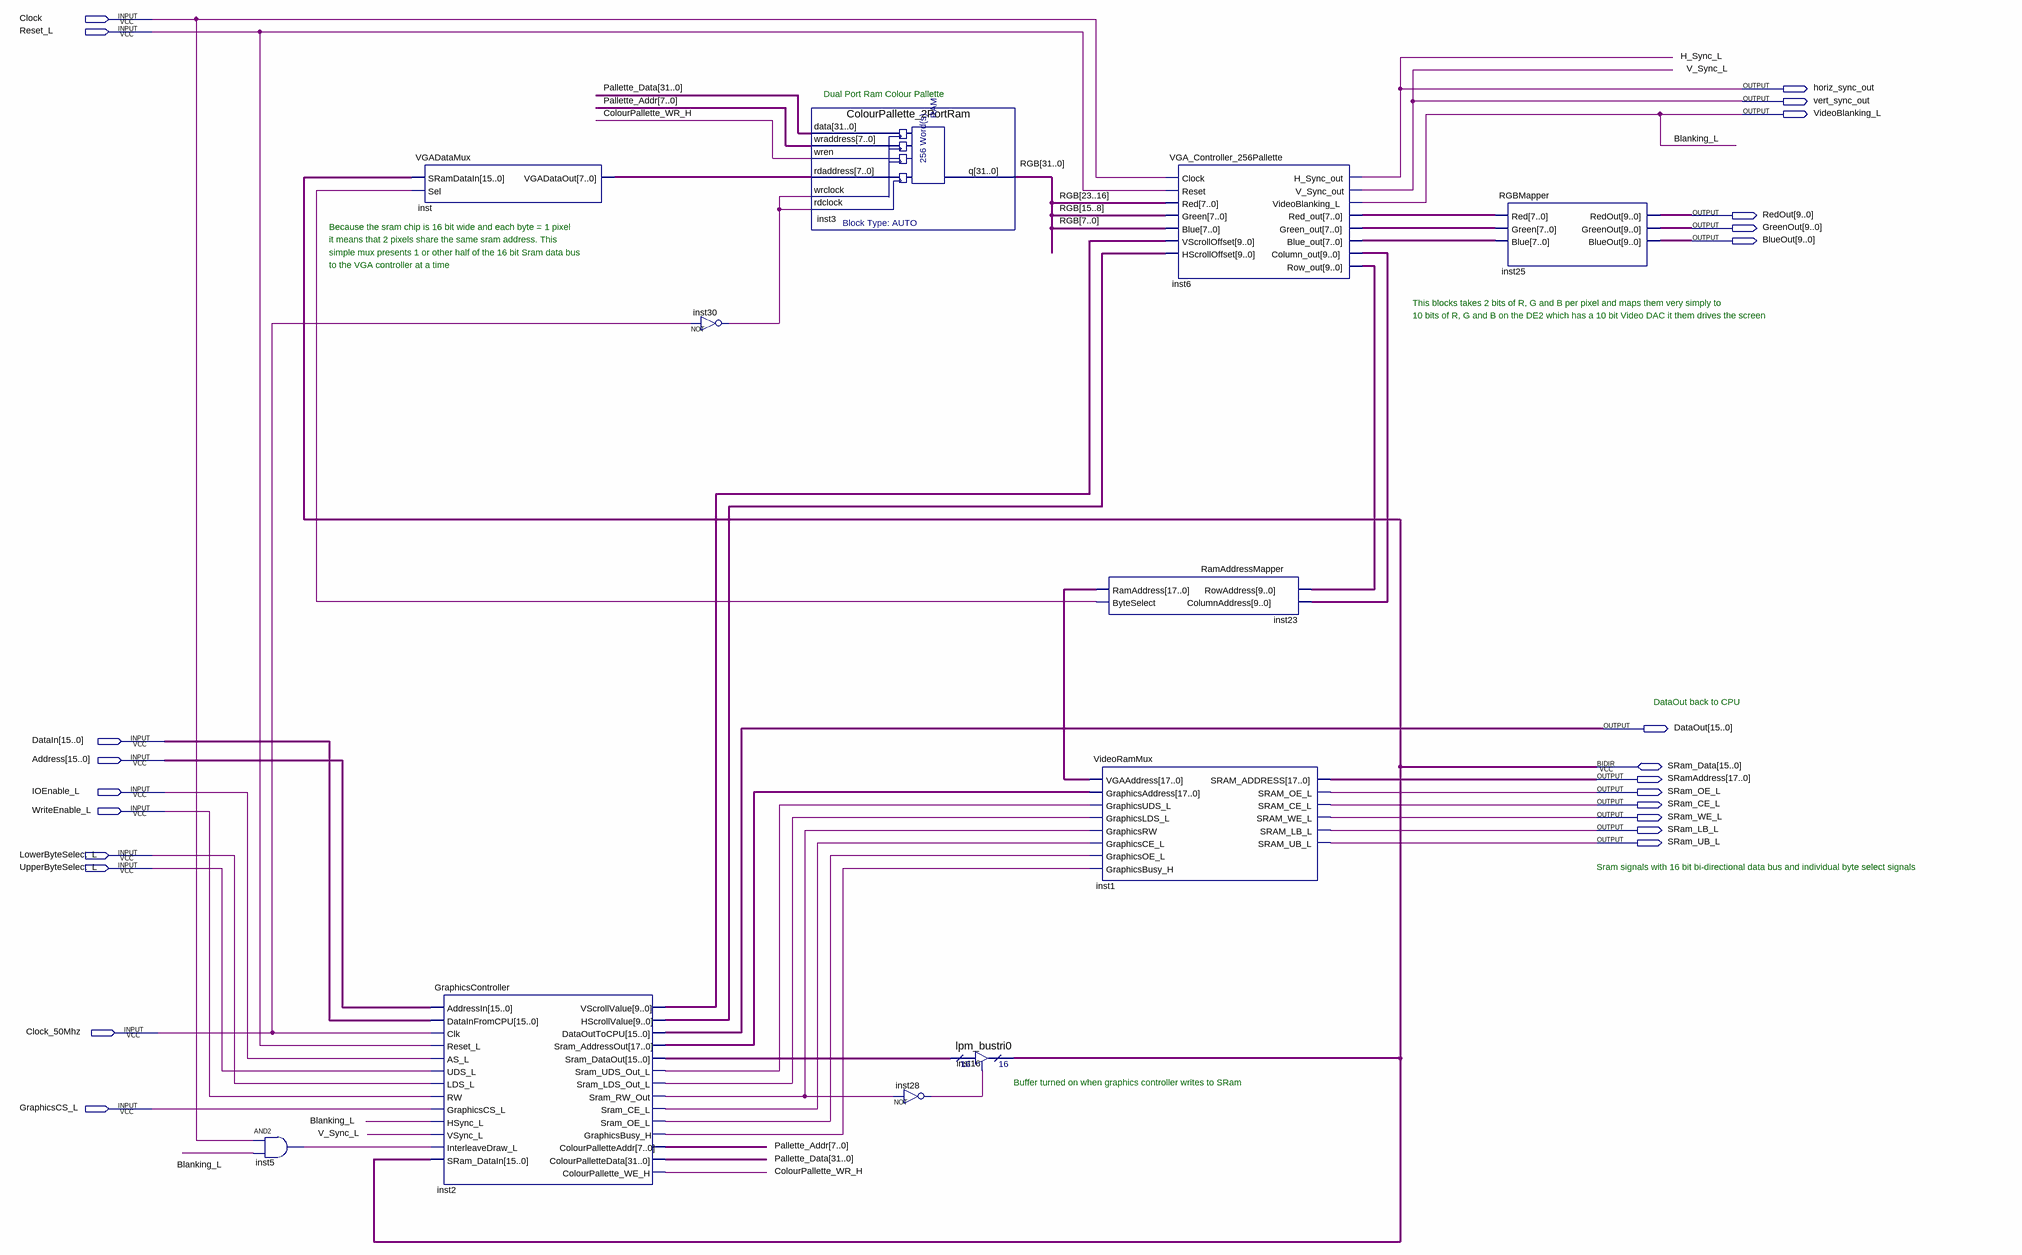
[diagram p0: schematic sheet]
// Quartus schematic Video_Controller800x480.bdf as structural Verilog: 11 symbols, 24 pins
module Video_Controller800x480 (
  input  Clock,
  input  Reset_L,
  input  [15:0] DataIn,
  input  [15:0] Address,
  input  IOEnable_L,
  input  WriteEnable_L,
  input  LowerByteSelect_L,
  input  UpperByteSelect_L,
  input  Clock_50Mhz,
  input  GraphicsCS_L,
  inout  [15:0] SRam_Data,
  output horiz_sync_out,
  output vert_sync_out,
  output VideoBlanking_L,
  output [9:0] RedOut,
  output [9:0] GreenOut,
  output [9:0] BlueOut,
  output [15:0] DataOut,
  output [17:0] SRamAddress,
  output SRam_OE_L,
  output SRam_CE_L,
  output SRam_WE_L,
  output SRam_LB_L,
  output SRam_UB_L
);

  wire ColourPallette_WR_H, inst2_graphicsbusy_h, inst2_sram_ce_l, inst2_sram_lds_out_l, inst2_sram_oe_l,
       inst2_sram_rw_out, inst2_sram_uds_out_l, inst5_out, inst23_byteselect, inst28_out, inst30_out;
  wire [7:0] inst6_blue_out, inst6_green_out, inst6_red_out, inst_vgadataout, Pallette_Addr;
  wire [9:0] inst2_hscrollvalue, inst2_vscrollvalue, inst6_column_out, inst6_row_out;
  wire [15:0] inst2_sram_dataout;
  wire [17:0] inst2_sram_addressout, inst23_ramaddress;
  wire [31:0] Pallette_Data, RGB;

  and inst5 (inst5_out, Clock, VideoBlanking_L);
  VGADataMux inst (.SRamDataIn(SRam_Data), .Sel(inst23_byteselect), .VGADataOut(inst_vgadataout));
  GraphicsController inst2 (
    .AddressIn(Address), .DataInFromCPU(DataIn), .Clk(Clock_50Mhz), .Reset_L(Reset_L), .AS_L(IOEnable_L),
    .UDS_L(UpperByteSelect_L), .LDS_L(LowerByteSelect_L), .RW(WriteEnable_L), .GraphicsCS_L(GraphicsCS_L),
    .HSync_L(VideoBlanking_L), .VSync_L(vert_sync_out), .InterleaveDraw_L(inst5_out),
    .SRam_DataIn(SRam_Data), .VScrollValue(inst2_vscrollvalue), .HScrollValue(inst2_hscrollvalue),
    .DataOutToCPU(DataOut), .Sram_AddressOut(inst2_sram_addressout), .Sram_DataOut(inst2_sram_dataout),
    .Sram_UDS_Out_L(inst2_sram_uds_out_l), .Sram_LDS_Out_L(inst2_sram_lds_out_l),
    .Sram_RW_Out(inst2_sram_rw_out), .Sram_CE_L(inst2_sram_ce_l), .Sram_OE_L(inst2_sram_oe_l),
    .GraphicsBusy_H(inst2_graphicsbusy_h), .ColourPalletteAddr(Pallette_Addr),
    .ColourPalletteData(Pallette_Data), .ColourPallette_WE_H(ColourPallette_WR_H));
  not inst30 (inst30_out, Clock_50Mhz);
  ColourPallette_2PortRam inst3 (
    .data(Pallette_Data), .wraddress(Pallette_Addr), .wren(ColourPallette_WR_H), .rdaddress(inst_vgadataout),
    .wrclock(inst30_out), .rdclock(inst30_out), .q(RGB));
  not inst28 (inst28_out, inst2_sram_rw_out);
  lpm_bustri0 inst16 (.enabledt(inst28_out), .data(inst2_sram_dataout), .tridata(SRam_Data));
  RamAddressMapper inst23 (
    .RowAddress(inst6_row_out), .ColumnAddress(inst6_column_out), .RamAddress(inst23_ramaddress),
    .ByteSelect(inst23_byteselect));
  VideoRamMux inst1 (
    .VGAAddress(inst23_ramaddress), .GraphicsAddress(inst2_sram_addressout),
    .GraphicsUDS_L(inst2_sram_uds_out_l), .GraphicsLDS_L(inst2_sram_lds_out_l),
    .GraphicsRW(inst2_sram_rw_out), .GraphicsCE_L(inst2_sram_ce_l), .GraphicsOE_L(inst2_sram_oe_l),
    .GraphicsBusy_H(inst2_graphicsbusy_h), .SRAM_ADDRESS(SRamAddress), .SRAM_OE_L(SRam_OE_L),
    .SRAM_CE_L(SRam_CE_L), .SRAM_WE_L(SRam_WE_L), .SRAM_LB_L(SRam_LB_L), .SRAM_UB_L(SRam_UB_L));
  VGA_Controller_256Pallette inst6 (
    .Clock(Clock), .Reset(Reset_L), .Red(RGB[23:16]), .Green(RGB[15:8]), .Blue(RGB[7:0]),
    .VScrollOffset(inst2_vscrollvalue), .HScrollOffset(inst2_hscrollvalue), .H_Sync_out(horiz_sync_out),
    .V_Sync_out(vert_sync_out), .VideoBlanking_L(VideoBlanking_L), .Red_out(inst6_red_out),
    .Green_out(inst6_green_out), .Blue_out(inst6_blue_out), .Column_out(inst6_column_out),
    .Row_out(inst6_row_out));
  RGBMapper inst25 (
    .Red(inst6_red_out), .Green(inst6_green_out), .Blue(inst6_blue_out), .RedOut(RedOut),
    .GreenOut(GreenOut), .BlueOut(BlueOut));

  // Other names for the same wires on the sheet: Blanking_L = VideoBlanking_L; H_Sync_L = horiz_sync_out;
  //   V_Sync_L = vert_sync_out

  // Notes on the sheet:
  //   Dual Port Ram Colour Pallette
  //   Because the sram chip is 16 bit wide and each byte = 1 pixel
  //   it means that 2 pixels share the same sram address. This
  //   simple mux presents 1 or other half of the 16 bit Sram data bus 
  //   to the VGA controller at a time
  //   This blocks takes 2 bits of R, G and B per pixel and maps them very simply to 
  //   10 bits of R, G and B on the DE2 which has a 10 bit Video DAC it them drives the screen
  //   DataOut back to CPU
  //   Sram signals with 16 bit bi-directional data bus and individual byte select signals
  //   Buffer turned on when graphics controller writes to SRam
endmodule
